# EAGLE design embedded (EAGLE 9.6.2)
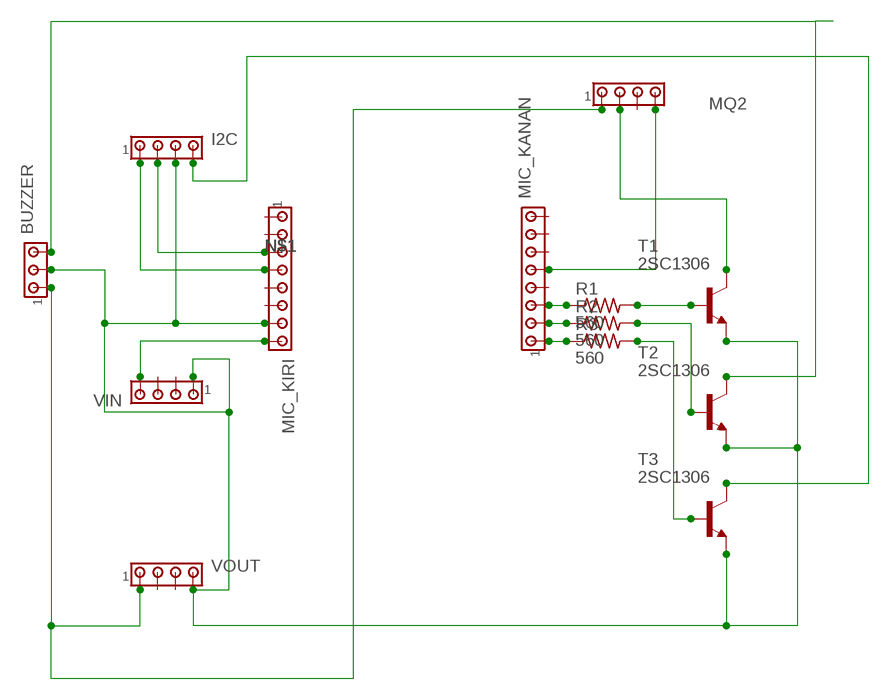
[diagram p0: schematic, sheet 1]

## Parts
BUZZER  MTA03-100  [10X03MTA]
I2C  MTA04-100  [10X04MTA]
MIC_KANAN  MTA08-100  [10X08MTA]
MIC_KIRI  MTA08-100  [10X08MTA]
MQ2  MTA04-100  [10X04MTA]
R1  560  R-US_0204/7  [0204/7]
R2  560  R-US_0204/7  [0204/7]
R3  560  R-US_0204/7  [0204/7]
T1  2SC1306  [TO220BV]
T2  2SC1306  [TO220BV]
T3  2SC1306  [TO220BV]
VIN  MTA04-100  [10X04MTA]
VOUT  MTA04-100  [10X04MTA]

## Nets
N$1: I2C.2 MIC_KIRI.3
N$2: BUZZER.2 I2C.3 MIC_KIRI.7 T1.3(E) T2.3(E) T3.3(E) VIN.1 VOUT.4
N$3: BUZZER.3 T2.2(C)
N$5: I2C.1 MIC_KIRI.4
N$6: MIC_KIRI.8 VIN.4
N$11: MIC_KANAN.3 R1.1
N$12: MIC_KANAN.2 R2.1
N$13: MIC_KANAN.1 R3.1
N$15: BUZZER.1 MQ2.1 VOUT.1
N$16: MQ2.2 T1.2(C)
N$17: MIC_KANAN.5 MQ2.4
N$19: R1.2 T1.1(B)
N$20: R2.2 T2.1(B)
N$21: R3.2 T3.1(B)
N$32: I2C.4 T3.2(C)
Unconnected: MIC_KANAN.4 MIC_KANAN.6 MIC_KANAN.7 MIC_KANAN.8 MIC_KIRI.1 MIC_KIRI.2 MIC_KIRI.5 MIC_KIRI.6 MQ2.3 VIN.2 VIN.3 VOUT.2 VOUT.3

## Library data of the parts
BUZZER = con-amp:MTA03-100: AMP connector
I2C MQ2 VIN VOUT = con-amp:MTA04-100: AMP connector
MIC_KANAN MIC_KIRI = con-amp:MTA08-100: AMP connector
R1-R3 = rcl:R-US_: RESISTOR, American symbol; SPICEPREFIX: R
T1-T3 = transistor:2SC1306: NPN Transistor Final RF Power Outupt Source: 2sc1306.pdf

## Board
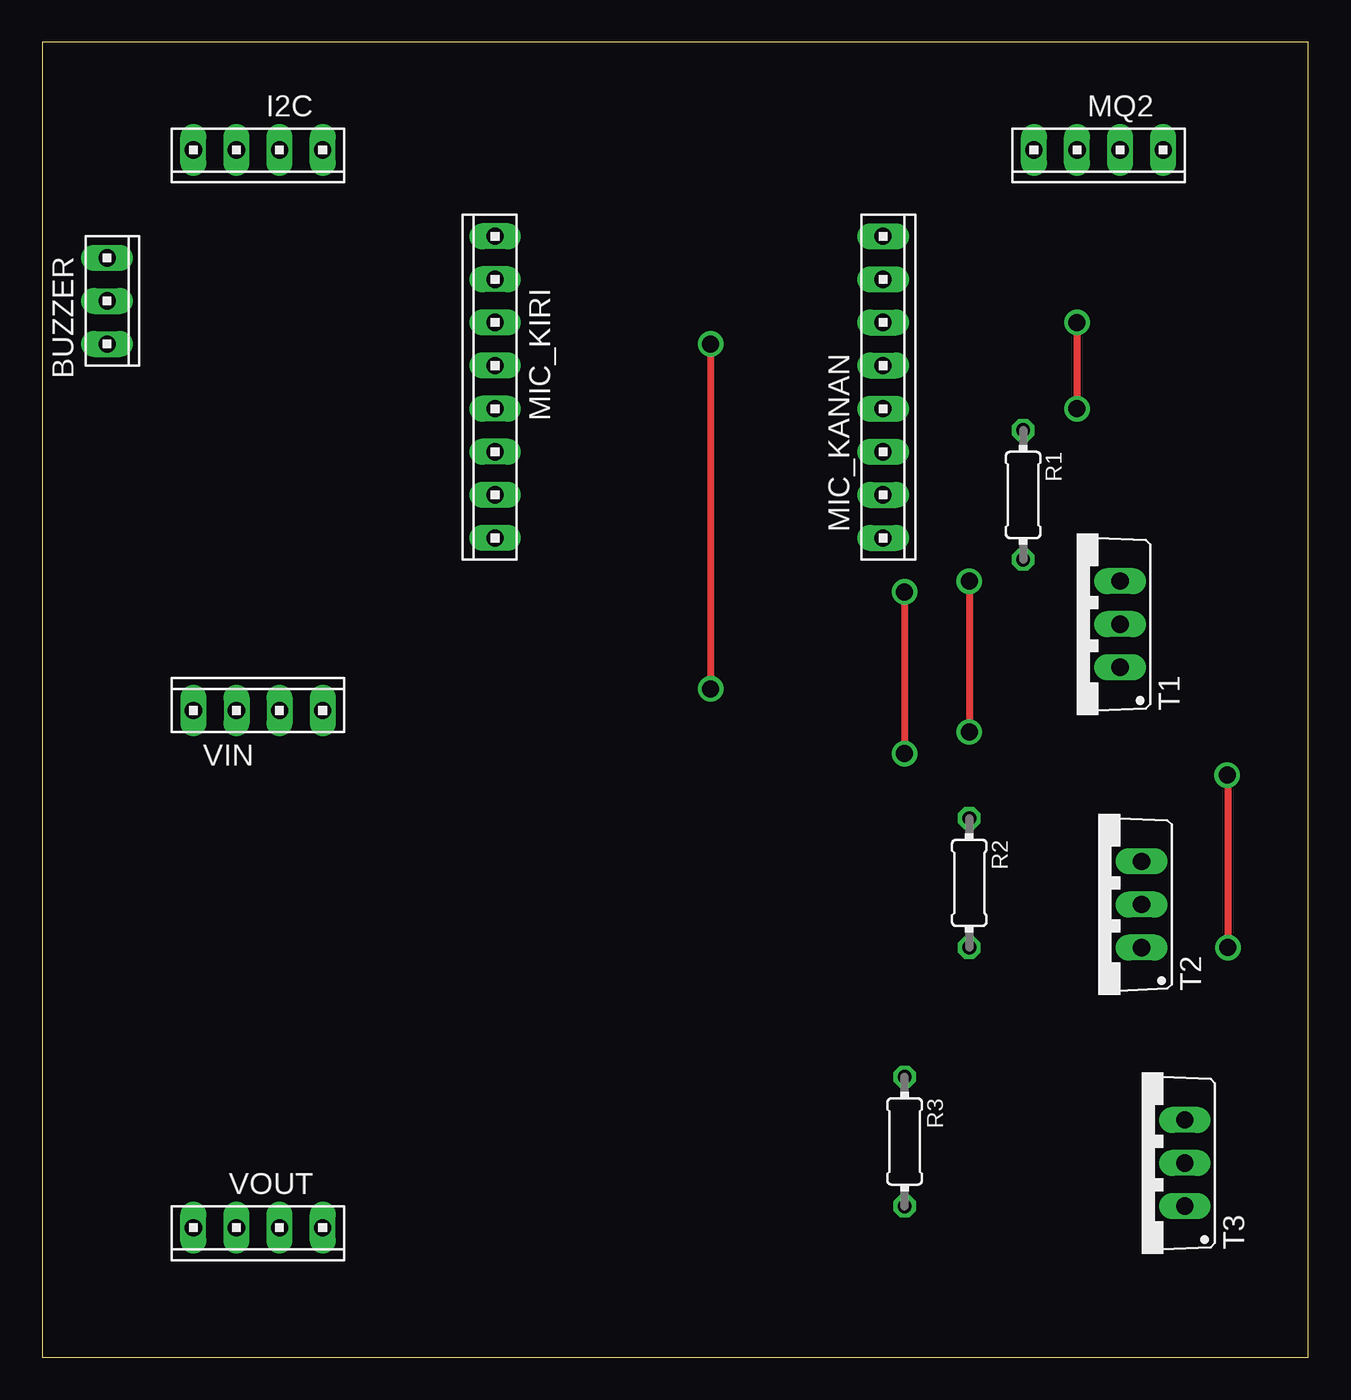
[diagram p1: board, top side]
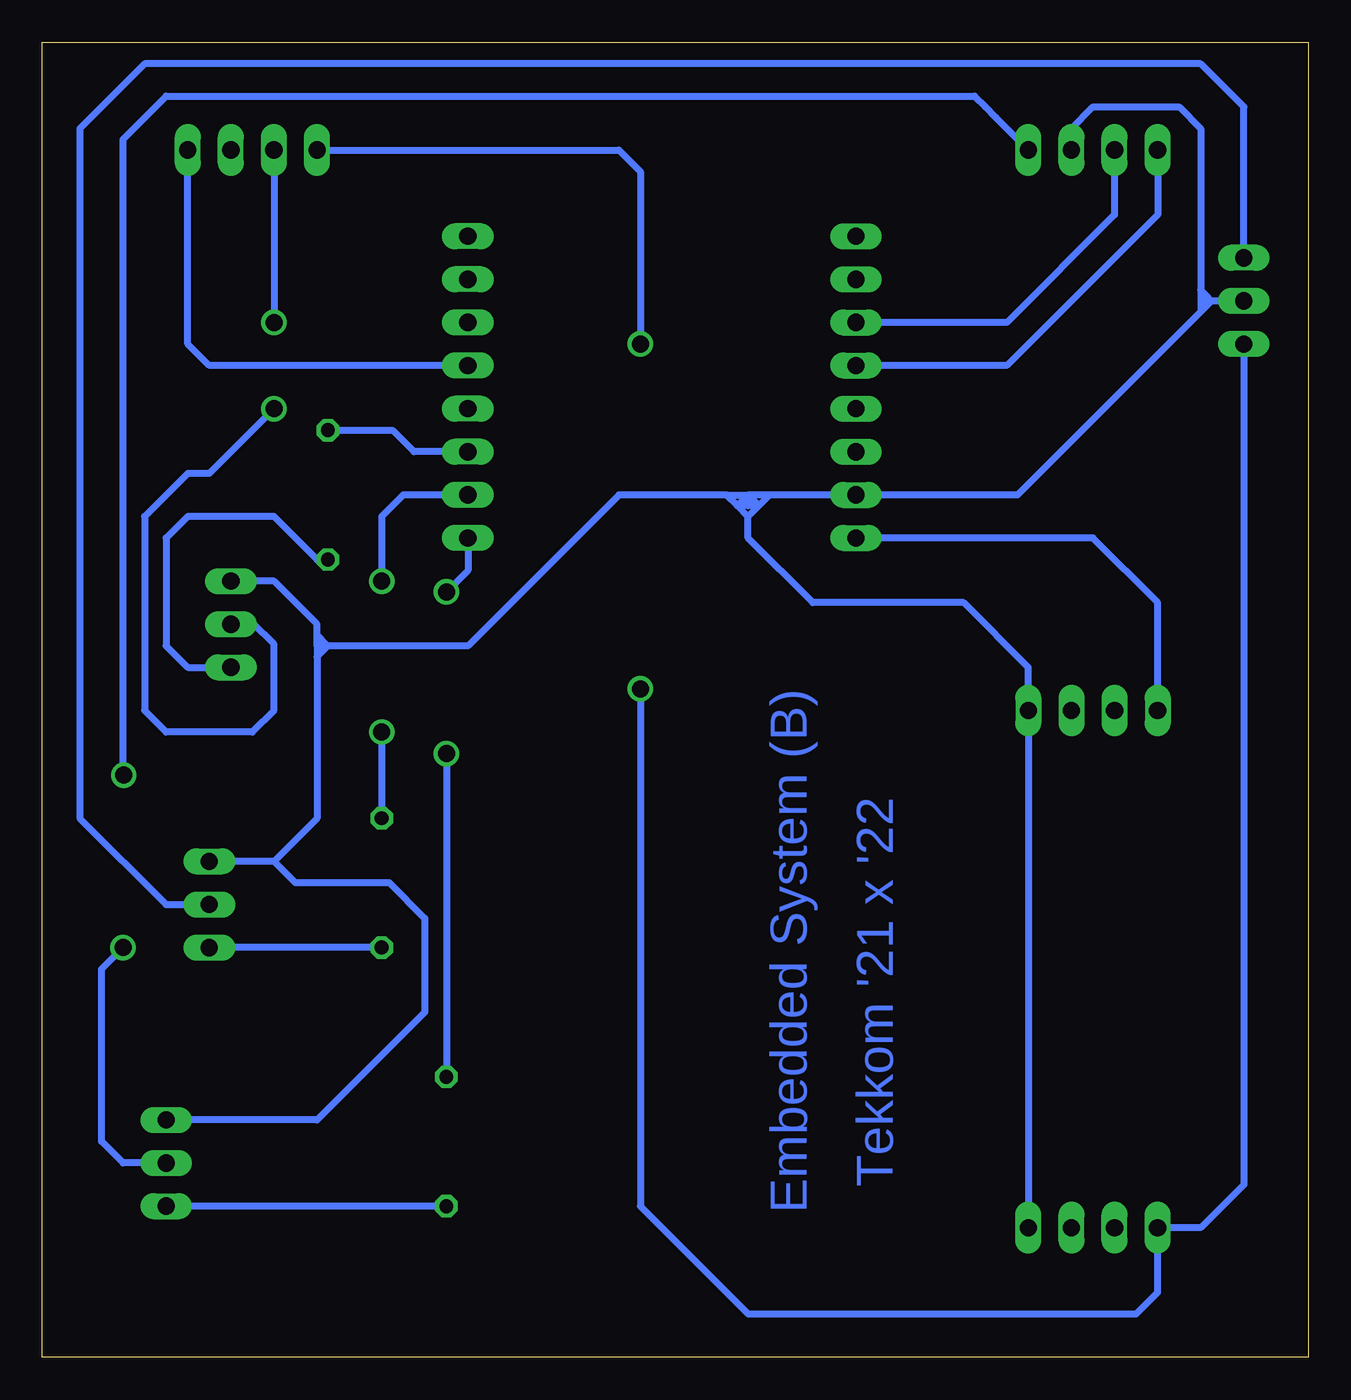
[diagram p2: board, bottom side, seen from below]

Size 74.6 x 77.46 mm. Coordinates in mm from the lower left corner, seen from the top.
Outline: 0,0 74.6,0 74.6,77.46 0,77.46 0,0
Copper layers (1*16): Top 0.035mm / dielectric 1.5mm / Bottom 0.035mm
Design rules "default *": minimum track width 6mil, minimum drill 0.35mm, track to track 14mil, track to pad 14mil, pad to pad 14mil, via to via 14mil, smd to smd 6mil, copper to edge 40mil, drill to drill 6mil, minimum pad ring 10mil, minimum via ring 8mil, stop-mask expansion 4mil, vias tented up to drill 0mil, thermal gap 10mil

### Footprints (pad centres in the part's own frame; a part is rotated, then mirrored left to right if it is on the bottom)
10X03MTA = drill 1.016 long: 1 2.54,0; 2 0,0; 3 -2.54,0
10X04MTA = drill 1.016 long: 1 3.81,0; 2 1.27,0; 3 -1.27,0; 4 -3.81,0
10X08MTA = drill 1.016 long: 1 8.89,0; 2 6.35,0; 3 3.81,0; 4 1.27,0; 5 -1.27,0; 6 -3.81,0; 7 -6.35,0; 8 -8.89,0
0204/7 = drill 0.813 octagon: 1 -3.81,0; 2 3.81,0
TO220BV = drill 1.016 long: 1 -2.54,-2.54; 2 0,-2.54; 3 2.54,-2.54

### Placement (x,y rotation side)
BUZZER  3.81,62.23 270 top
I2C  12.7,71.12 180 top
MIC_KANAN  49.53,57.15 270 top
MIC_KIRI  26.67,57.15 90 top
MQ2  62.23,71.12 180 top
R1  57.79,50.8 270 top
R2  54.61,27.94 270 top
R3  50.8,12.7 270 top
T1  60.96,43.18 90 top
T2  62.23,26.67 90 top
T3  64.77,11.43 90 top
VIN  12.7,38.1 0 top
VOUT  12.7,7.62 180 top

### Tracks (layer width: path | path; a pad name or v marks a point on that pad's centre or on a via)
N$1
  Bottom 0.406: I2C.2 11.43,67.31 17.78,60.96 MIC_KIRI.3
N$2
  Bottom 0.406: VOUT.4 VIN.1 16.51,40.64 20.32,44.45 29.21,44.45 33.02,48.26 33.02,49.53 | MIC_KIRI.7 17.14,50.8 6.35,61.59 | I2C.3 13.97,72.39 12.7,73.66 7.62,73.66 6.35,72.39 6.35,62.86 | MIC_KIRI.7 31.75,50.8 | 31.75,50.8 33.02,50.8 | 34.29,50.8 40.64,50.8 49.53,41.91 57.79,41.91 | MIC_KIRI.7 27.94,50.8 | 58.42,41.91 58.42,42.55 | 58.42,42.55 58.42,43.18 60.96,45.72 T1.3 | 58.42,41.91 58.42,41.27 | 58.42,41.27 58.42,31.75 60.96,29.21 | 60.96,29.21 T2.3 64.68,29.21 | T3.3 58.42,13.97 52.07,20.32 52.07,25.85 54.16,27.94 59.69,27.94 60.96,29.21 | 31.75,50.8 32.39,50.16 | 32.39,50.16 33.02,49.53 | 33.02,49.53 33.66,50.16 | 33.66,50.16 34.29,50.8 | 32.39,50.16 33.02,50.16 | 33.02,50.16 33.66,50.16 | 33.02,50.8 32.39,50.16 | 33.02,50.8 33.02,50.16 | 34.29,50.8 33.02,50.8 | 33.02,50.8 33.66,50.16 | 58.42,41.91 57.79,41.91 | BUZZER.2 5.72,62.23 | 5.72,62.23 6.03,62.55 | 6.03,62.55 6.35,62.86 | 5.72,62.23 6.03,61.91 | 6.03,61.91 6.35,61.59 | 6.03,62.55 6.03,61.91 | 6.35,62.86 6.35,61.59 | 57.79,41.91 58.42,41.27 | 57.79,41.91 58.42,42.55
N$3
  Bottom 0.406: BUZZER.3 3.81,73.66 6.35,76.2 68.58,76.2 72.39,72.39 72.39,31.75 67.31,26.67 T2.2
N$5
  Bottom 0.406: I2C.1 8.89,67.31 17.78,58.42 MIC_KIRI.4
N$6
  Bottom 0.406: VIN.4 8.89,44.45 12.7,48.26 MIC_KIRI.8
N$11
  Bottom 0.406: R1.1 53.98,54.61 52.71,53.34 MIC_KANAN.3
N$12  (via drill 1)
  Top 0.406: v54.61,45.72 v54.61,36.83
  Bottom 0.406: MIC_KANAN.2 53.34,50.8 54.61,49.53 v54.61,45.72 | v54.61,36.83 R2.1
N$13  (via drill 1)
  Top 0.406: v50.8,45.09 v50.8,35.56
  Bottom 0.406: MIC_KANAN.1 49.53,46.35 v50.8,45.09 | v50.8,35.56 R3.1
N$15  (via drill 1)
  Top 0.406: v39.37,59.69 v39.37,39.37
  Bottom 0.406: MQ2.1 40.64,71.12 39.37,69.85 v39.37,59.69 | BUZZER.1 3.81,10.16 6.35,7.62 VOUT.1 8.89,3.81 10.16,2.54 33.02,2.54 39.37,8.89 v39.37,39.37
N$16  (via drill 1)
  Top 0.406: v60.96,60.96 v60.96,55.88
  Bottom 0.406: 60.96,71.03 MQ2.2 v60.96,60.96 | T1.2 63.45,43.23 62.19,43.23 60.96,42 60.96,38.1 62.23,36.83 67.31,36.83 68.58,38.1 68.58,49.53 66.04,52.07 64.77,52.07 v60.96,55.88
N$17
  Bottom 0.406: MQ2.4 66.04,59.69 64.77,58.42 MIC_KANAN.5
N$19
  Bottom 0.406: R1.2 58.42,46.99 60.96,49.53 66.04,49.53 67.31,48.26 67.31,41.91 66.04,40.64 T1.1
N$20  (via drill 0.35)
  Bottom 0.406: R2.2 T2.1
  other vias: 54.61,24.13
N$21
  Bottom 0.406: R3.2 T3.1
N$32  (via drill 1)
  Top 0.406: v69.81,34.29 69.85,34.25 v69.85,24.13
  Bottom 0.406: I2C.4 18.41,73.02 19.05,73.66 19.68,74.3 67.31,74.3 69.85,71.75 69.85,34.29 v69.81,34.29 | 67.4,11.43 T3.2 69.85,11.43 71.12,12.7 71.12,22.86 v69.85,24.13

### Text on the board
Bottom: Embedded System (B) | Tekkom '21 x '22